# Altium schematic sheet TOP.SchDoc: STM32F769 Discovery Interconnexion
size A4; Date: 29-OCT-2015; Author: A.B; CompanyName: STMicroelectronics; Organization: MCD/TOOLS/GNB; Address1: 12, Rue Jules HOROWITZ; Address2: 38019 Grenoble; Address3: FRANCE; DocumentNumber: MB1225; Revision: B-01; SheetNumber: 2; SheetTotal: 13; Project: STM32F769I-DISCO
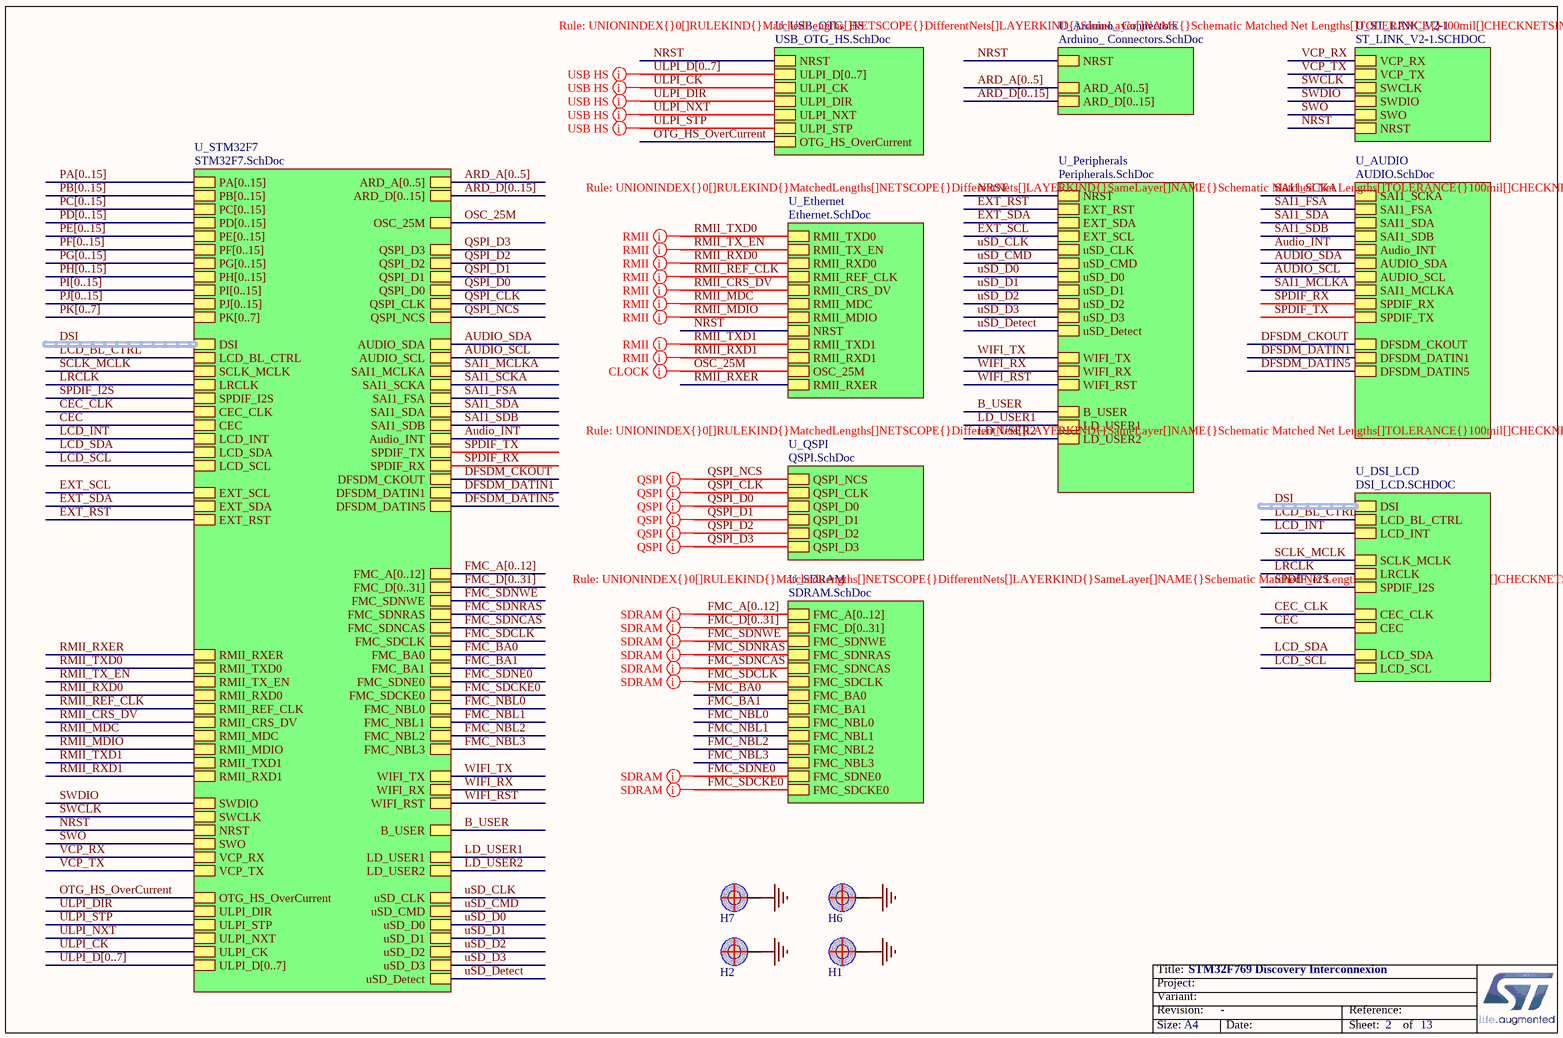
[diagram p0: TOP.SchDoc]

## Parts
H1  POSITION HOLE C6D3R5  [HOLE_C6D3R5]  (value not drawn)
H2  POSITION HOLE C6D3R5  [HOLE_C6D3R5]  (value not drawn)
H6  POSITION HOLE C6D3R5  [HOLE_C6D3R5]  (value not drawn)
H7  POSITION HOLE C6D3R5  [HOLE_C6D3R5]  (value not drawn)

## Sub-sheets
U_Arduino_ Connectors = Arduino_ Connectors.SchDoc: NRST, ARD_D[0..15], ARD_A[0..5]
U_AUDIO = AUDIO.SchDoc: AUDIO_SDA, AUDIO_SCL, SAI1_MCLKA, SPDIF_RX, SAI1_SCKA, SAI1_FSA, SAI1_SDA, SAI1_SDB, Audio_INT, SPDIF_TX, DFSDM_CKOUT, DFSDM_DATIN1, DFSDM_DATIN5
U_DSI_LCD = DSI_LCD.SCHDOC: DSI (harness DSI), LCD_INT, LCD_BL_CTRL, SCLK_MCLK, LRCLK, SPDIF_I2S, CEC_CLK, CEC, LCD_SDA, LCD_SCL
U_Ethernet = Ethernet.SchDoc: RMII_TXD0, RMII_TX_EN, RMII_RXD0, RMII_REF_CLK, RMII_CRS_DV, RMII_MDC, RMII_MDIO, NRST, RMII_TXD1, RMII_RXD1, OSC_25M, RMII_RXER
U_Peripherals = Peripherals.SchDoc: NRST, EXT_RST, EXT_SCL, EXT_SDA, uSD_CLK, uSD_CMD, uSD_D0, uSD_D1, uSD_D2, uSD_D3, uSD_Detect, B_USER, WIFI_TX, WIFI_RX, WIFI_RST, LD_USER1, LD_USER2
U_QSPI = QSPI.SchDoc: QSPI_D0, QSPI_D3, QSPI_D1, QSPI_CLK, QSPI_NCS, QSPI_D2
U_SDRAM = SDRAM.SchDoc: FMC_A[0..12], FMC_SDNWE, FMC_SDNRAS, FMC_SDNCAS, FMC_SDCLK, FMC_BA0, FMC_BA1, FMC_NBL0, FMC_NBL1, FMC_SDNE0, FMC_SDCKE0, FMC_D[0..31], FMC_NBL2, FMC_NBL3
U_ST_LINK_V2-1 = ST_LINK_V2-1.SCHDOC: SWDIO, SWCLK, NRST, VCP_RX, VCP_TX, SWO
U_STM32F7 = STM32F7.SchDoc: PA[0..15], PB[0..15], PC[0..15], PD[0..15], PE[0..15], PF[0..15], PG[0..15], PH[0..15], PI[0..15], PJ[0..15], PK[0..7], OSC_25M, RMII_TXD0, RMII_TX_EN, RMII_RXD0, RMII_REF_CLK, RMII_CRS_DV, RMII_MDC, RMII_MDIO, RMII_TXD1, RMII_RXD1, ULPI_D[0..7], ULPI_CK, ULPI_DIR, ULPI_NXT, ULPI_STP, QSPI_D0, QSPI_D3, QSPI_D1, QSPI_CLK, QSPI_NCS, AUDIO_SDA, AUDIO_SCL, SAI1_MCLKA, EXT_SCL, EXT_SDA, EXT_RST, uSD_CLK, uSD_CMD, uSD_D0, uSD_D1, uSD_D2, uSD_D3, uSD_Detect, SWDIO, SWCLK, NRST, SWO, VCP_RX, VCP_TX, FMC_A[0..12], FMC_D[0..31], FMC_SDNWE, FMC_SDNRAS, FMC_SDNCAS, FMC_SDCLK, FMC_BA0, FMC_BA1, FMC_SDNE0, FMC_SDCKE0, FMC_NBL0, FMC_NBL1, SPDIF_RX, QSPI_D2, B_USER, ARD_D[0..15], RMII_RXER, OTG_HS_OverCurrent, SAI1_SCKA, SAI1_FSA, SAI1_SDA, SAI1_SDB, Audio_INT, SPDIF_TX, FMC_NBL2, FMC_NBL3, DSI (harness DSI), LCD_BL_CTRL, SCLK_MCLK, LRCLK, SPDIF_I2S, CEC_CLK, CEC, LCD_INT, LCD_SDA, LCD_SCL, WIFI_RST, WIFI_RX, WIFI_TX, ARD_A[0..5], LD_USER1, LD_USER2, DFSDM_CKOUT, DFSDM_DATIN1, DFSDM_DATIN5
U_USB_OTG_HS = USB_OTG_HS.SchDoc: ULPI_D[0..7], ULPI_CK, ULPI_DIR, ULPI_NXT, ULPI_STP, NRST, OTG_HS_OverCurrent

## Nets
GND: H1.1 H2.1 H6.1 H7.1
Audio_INT: sheet U_AUDIO/Audio_INT, sheet U_STM32F7/Audio_INT
AUDIO_SCL: sheet U_AUDIO/AUDIO_SCL, sheet U_STM32F7/AUDIO_SCL
AUDIO_SDA: sheet U_AUDIO/AUDIO_SDA, sheet U_STM32F7/AUDIO_SDA
B_USER: sheet U_Peripherals/B_USER, sheet U_STM32F7/B_USER
CEC: sheet U_STM32F7/CEC, sheet U_DSI_LCD/CEC
CEC_CLK: sheet U_STM32F7/CEC_CLK, sheet U_DSI_LCD/CEC_CLK
DFSDM_CKOUT: sheet U_AUDIO/DFSDM_CKOUT, sheet U_STM32F7/DFSDM_CKOUT
DFSDM_DATIN1: sheet U_AUDIO/DFSDM_DATIN1, sheet U_STM32F7/DFSDM_DATIN1
DFSDM_DATIN5: sheet U_AUDIO/DFSDM_DATIN5, sheet U_STM32F7/DFSDM_DATIN5
EXT_RST: sheet U_Peripherals/EXT_RST, sheet U_STM32F7/EXT_RST
EXT_SCL: sheet U_Peripherals/EXT_SCL, sheet U_STM32F7/EXT_SCL
EXT_SDA: sheet U_Peripherals/EXT_SDA, sheet U_STM32F7/EXT_SDA
FMC_BA0: sheet U_SDRAM/FMC_BA0, sheet U_STM32F7/FMC_BA0
FMC_BA1: sheet U_SDRAM/FMC_BA1, sheet U_STM32F7/FMC_BA1
FMC_NBL0: sheet U_SDRAM/FMC_NBL0, sheet U_STM32F7/FMC_NBL0
FMC_NBL1: sheet U_SDRAM/FMC_NBL1, sheet U_STM32F7/FMC_NBL1
FMC_NBL2: sheet U_SDRAM/FMC_NBL2, sheet U_STM32F7/FMC_NBL2
FMC_NBL3: sheet U_SDRAM/FMC_NBL3, sheet U_STM32F7/FMC_NBL3
FMC_SDCKE0: sheet U_SDRAM/FMC_SDCKE0, sheet U_STM32F7/FMC_SDCKE0
FMC_SDCLK: sheet U_SDRAM/FMC_SDCLK, sheet U_STM32F7/FMC_SDCLK
FMC_SDNCAS: sheet U_SDRAM/FMC_SDNCAS, sheet U_STM32F7/FMC_SDNCAS
FMC_SDNE0: sheet U_SDRAM/FMC_SDNE0, sheet U_STM32F7/FMC_SDNE0
FMC_SDNRAS: sheet U_SDRAM/FMC_SDNRAS, sheet U_STM32F7/FMC_SDNRAS
FMC_SDNWE: sheet U_SDRAM/FMC_SDNWE, sheet U_STM32F7/FMC_SDNWE
LCD_BL_CTRL: sheet U_STM32F7/LCD_BL_CTRL, sheet U_DSI_LCD/LCD_BL_CTRL
LCD_INT: sheet U_STM32F7/LCD_INT, sheet U_DSI_LCD/LCD_INT
LCD_SCL: sheet U_STM32F7/LCD_SCL, sheet U_DSI_LCD/LCD_SCL
LCD_SDA: sheet U_STM32F7/LCD_SDA, sheet U_DSI_LCD/LCD_SDA
LD_USER1: sheet U_Peripherals/LD_USER1, sheet U_STM32F7/LD_USER1
LD_USER2: sheet U_Peripherals/LD_USER2, sheet U_STM32F7/LD_USER2
LRCLK: sheet U_STM32F7/LRCLK, sheet U_DSI_LCD/LRCLK
NRST: sheet U_ST_LINK_V2-1/NRST, sheet U_Peripherals/NRST, sheet U_Arduino_ Connectors/NRST, sheet U_USB_OTG_HS/NRST, sheet U_STM32F7/NRST, sheet U_Ethernet/NRST
OSC_25M: sheet U_STM32F7/OSC_25M, sheet U_Ethernet/OSC_25M
OTG_HS_OverCurrent: sheet U_USB_OTG_HS/OTG_HS_OverCurrent, sheet U_STM32F7/OTG_HS_OverCurrent
QSPI_CLK: sheet U_QSPI/QSPI_CLK, sheet U_STM32F7/QSPI_CLK
QSPI_D0: sheet U_QSPI/QSPI_D0, sheet U_STM32F7/QSPI_D0
QSPI_D1: sheet U_QSPI/QSPI_D1, sheet U_STM32F7/QSPI_D1
QSPI_D2: sheet U_QSPI/QSPI_D2, sheet U_STM32F7/QSPI_D2
QSPI_D3: sheet U_QSPI/QSPI_D3, sheet U_STM32F7/QSPI_D3
QSPI_NCS: sheet U_QSPI/QSPI_NCS, sheet U_STM32F7/QSPI_NCS
RMII_CRS_DV: sheet U_STM32F7/RMII_CRS_DV, sheet U_Ethernet/RMII_CRS_DV
RMII_MDC: sheet U_STM32F7/RMII_MDC, sheet U_Ethernet/RMII_MDC
RMII_MDIO: sheet U_STM32F7/RMII_MDIO, sheet U_Ethernet/RMII_MDIO
RMII_REF_CLK: sheet U_STM32F7/RMII_REF_CLK, sheet U_Ethernet/RMII_REF_CLK
RMII_RXD0: sheet U_STM32F7/RMII_RXD0, sheet U_Ethernet/RMII_RXD0
RMII_RXD1: sheet U_STM32F7/RMII_RXD1, sheet U_Ethernet/RMII_RXD1
RMII_RXER: sheet U_STM32F7/RMII_RXER, sheet U_Ethernet/RMII_RXER
RMII_TX_EN: sheet U_STM32F7/RMII_TX_EN, sheet U_Ethernet/RMII_TX_EN
RMII_TXD0: sheet U_STM32F7/RMII_TXD0, sheet U_Ethernet/RMII_TXD0
RMII_TXD1: sheet U_STM32F7/RMII_TXD1, sheet U_Ethernet/RMII_TXD1
SAI1_FSA: sheet U_AUDIO/SAI1_FSA, sheet U_STM32F7/SAI1_FSA
SAI1_MCLKA: sheet U_AUDIO/SAI1_MCLKA, sheet U_STM32F7/SAI1_MCLKA
SAI1_SCKA: sheet U_AUDIO/SAI1_SCKA, sheet U_STM32F7/SAI1_SCKA
SAI1_SDA: sheet U_AUDIO/SAI1_SDA, sheet U_STM32F7/SAI1_SDA
SAI1_SDB: sheet U_AUDIO/SAI1_SDB, sheet U_STM32F7/SAI1_SDB
SCLK_MCLK: sheet U_STM32F7/SCLK_MCLK, sheet U_DSI_LCD/SCLK_MCLK
SPDIF_I2S: sheet U_STM32F7/SPDIF_I2S, sheet U_DSI_LCD/SPDIF_I2S
SPDIF_RX: sheet U_AUDIO/SPDIF_RX, sheet U_STM32F7/SPDIF_RX
SPDIF_TX: sheet U_AUDIO/SPDIF_TX, sheet U_STM32F7/SPDIF_TX
SWCLK: sheet U_ST_LINK_V2-1/SWCLK, sheet U_STM32F7/SWCLK
SWDIO: sheet U_ST_LINK_V2-1/SWDIO, sheet U_STM32F7/SWDIO
SWO: sheet U_ST_LINK_V2-1/SWO, sheet U_STM32F7/SWO
ULPI_CK: sheet U_USB_OTG_HS/ULPI_CK, sheet U_STM32F7/ULPI_CK
ULPI_DIR: sheet U_USB_OTG_HS/ULPI_DIR, sheet U_STM32F7/ULPI_DIR
ULPI_NXT: sheet U_USB_OTG_HS/ULPI_NXT, sheet U_STM32F7/ULPI_NXT
ULPI_STP: sheet U_USB_OTG_HS/ULPI_STP, sheet U_STM32F7/ULPI_STP
uSD_CLK: sheet U_Peripherals/uSD_CLK, sheet U_STM32F7/uSD_CLK
uSD_CMD: sheet U_Peripherals/uSD_CMD, sheet U_STM32F7/uSD_CMD
uSD_D0: sheet U_Peripherals/uSD_D0, sheet U_STM32F7/uSD_D0
uSD_D1: sheet U_Peripherals/uSD_D1, sheet U_STM32F7/uSD_D1
uSD_D2: sheet U_Peripherals/uSD_D2, sheet U_STM32F7/uSD_D2
uSD_D3: sheet U_Peripherals/uSD_D3, sheet U_STM32F7/uSD_D3
uSD_Detect: sheet U_Peripherals/uSD_Detect, sheet U_STM32F7/uSD_Detect
VCP_RX: sheet U_ST_LINK_V2-1/VCP_RX, sheet U_STM32F7/VCP_RX
VCP_TX: sheet U_ST_LINK_V2-1/VCP_TX, sheet U_STM32F7/VCP_TX
WIFI_RST: sheet U_Peripherals/WIFI_RST, sheet U_STM32F7/WIFI_RST
WIFI_RX: sheet U_Peripherals/WIFI_RX, sheet U_STM32F7/WIFI_RX
WIFI_TX: sheet U_Peripherals/WIFI_TX, sheet U_STM32F7/WIFI_TX

## Buses and harness runs
bus ARD_A[0..5] = sheet U_Arduino_ Connectors/ARD_A[0..5]
bus ARD_A[0..5] = sheet U_STM32F7/ARD_A[0..5]
bus ARD_D[0..15] = sheet U_Arduino_ Connectors/ARD_D[0..15]
bus ARD_D[0..15] = sheet U_STM32F7/ARD_D[0..15]
bus FMC_A[0..12] = sheet U_SDRAM/FMC_A[0..12]
bus FMC_A[0..12] = sheet U_STM32F7/FMC_A[0..12]
bus FMC_D[0..31] = sheet U_SDRAM/FMC_D[0..31]
bus FMC_D[0..31] = sheet U_STM32F7/FMC_D[0..31]
bus PA[0..15] = sheet U_STM32F7/PA[0..15]
bus PB[0..15] = sheet U_STM32F7/PB[0..15]
bus PC[0..15] = sheet U_STM32F7/PC[0..15]
bus PD[0..15] = sheet U_STM32F7/PD[0..15]
bus PE[0..15] = sheet U_STM32F7/PE[0..15]
bus PF[0..15] = sheet U_STM32F7/PF[0..15]
bus PG[0..15] = sheet U_STM32F7/PG[0..15]
bus PH[0..15] = sheet U_STM32F7/PH[0..15]
bus PI[0..15] = sheet U_STM32F7/PI[0..15]
bus PJ[0..15] = sheet U_STM32F7/PJ[0..15]
bus PK[0..7] = sheet U_STM32F7/PK[0..7]
bus ULPI_D[0..7] = sheet U_STM32F7/ULPI_D[0..7]
bus ULPI_D[0..7] = sheet U_USB_OTG_HS/ULPI_D[0..7]
harness DSI = sheet U_DSI_LCD/DSI
harness DSI = sheet U_STM32F7/DSI

## Layout directives
rule Matched Net Lengths [Tolerance = 100mil]: (no net found under the mark), FMC_SDCKE0, FMC_SDCLK, FMC_SDNCAS, FMC_SDNE0, FMC_SDNRAS, FMC_SDNWE, QSPI_CLK, QSPI_D0, QSPI_D1, QSPI_D2, QSPI_D3, QSPI_NCS, RMII_CRS_DV, RMII_MDC, RMII_MDIO, RMII_REF_CLK, RMII_RXD0, RMII_RXD1, RMII_TX_EN, RMII_TXD0, RMII_TXD1, ULPI_CK, ULPI_DIR, ULPI_NXT, ULPI_STP
rule Undefined: OSC_25M

## Notes on the sheet
- Title:
- Project:
- Size:
- Revision:
- Variant:
- A4
- -
- Date:
- Reference:
- Sheet:
- of